# Altium schematic sheet rotary_enc.SchDoc
size B; SheetNumber: 1; SheetTotal: 3
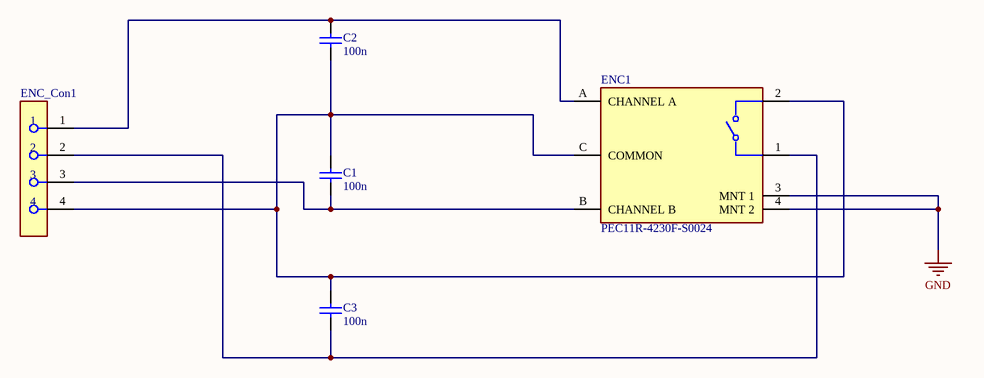
[diagram p0: rotary_enc.SchDoc]

## Parts
C1  100n  [Capacitor_1206]
C2  100n  [Capacitor_1206]
C3  100n  [Capacitor_1206]
ENC1  PEC11R-4230F-S0024  [Rotary_Encoder_PEC11R-4230F-S0024]
ENC_Con1  (no value)  [Header-Female-JST_4pin]

## Nets
GND: ENC1.3(MNT_1) ENC1.4(MNT_2)
NetC1_1: C1.1 ENC1.B(CHANNEL_B) ENC_Con1.3
NetC1_2: C1.2 C2.1 C3.2 ENC1.2 ENC1.C(COMMON) ENC_Con1.4
NetC2_2: C2.2 ENC1.A(CHANNEL_A) ENC_Con1.1
NetC3_1: C3.1 ENC1.1 ENC_Con1.2

## Library data of the parts
C1-C3 = Capacitor_1206: CAP, Ceramic, 0.1 uF, +/- 10%, 50 V, -55 to 125 degC, 1206 (3216 Metric), RoHS, Tape and Reel; Manufacturer: Kemet; Voltage Rating: 50V; Capacitance: 0.1µF; Product Range: KEMET-CSeries; SVHC: ToBeAdvised; Dielectric Characteristic: X7R; Capacitor Case Style: 1206[3216Metric]; Package Reference: 1206-2; Package Description: 2-Leads SMD, Body 3.2 x 1.6 mm; Packaging: Tape&Reel; Operating Temperature Max: 125degC; Capacitance Tolerance: ±10%; Datasheet URL: https://datasheet.ciiva.com/6125/1725438-6125494.pdf; Manufacturer URL: http://www.kemet.com/; Operating Temperature Min: -55degC; Datasheet Version: Jul-13
ENC1 = Rotary_Encoder_PEC11R-4230F-S0024: ROTARY ENCODER MECHANICAL 24PPR; Detent: Yes; Number of Channels: 2; Output Type: Quadrature; Pulses per Revolution: 24; Hole Diameter: 1.8mm; Package Quantity: 75; REACH SVHC: No SVHC; Width: 12.5mm; Packaging: Bulk; Orientation: Vertical; Mount: Through Hole; Length: 36.5mm; Height: 13.4mm; Series: PEC11R; Min Operating Temperature: -30°C; Built in Switch: Yes; Max Operating Temperature: 70°C; Encoder Type: Mechanical; Termination: PC Pin; RoHS Compliant: Yes
ENC_Con1 = Header-Female-JST_4pin: Contact Resistance: 10mR; Number of Positions: 4; Pitch: 2.54mm; Gender: Female; Connector Type: Receptacle; Max Current Rating: 1A; Color: Black; Contact Material: Copper; Min Operating Temperature: -55°C; Max Operating Temperature: 125°C; Radiation Hardening: No; Termination: Solder; Depth: 2.54mm; Contact Plating: Gold; Orientation: Straight; Housing Color: Black; Width: 2.54mm; RoHS Compliant: Yes; Lead Free: Lead Free; Mount: Through Hole; Series: SS; Length: 10.16mm; Packaging: Bulk; Package Quantity: 1; Housing Material: Polyester; Number of Contacts: 4; Number of Rows: 1